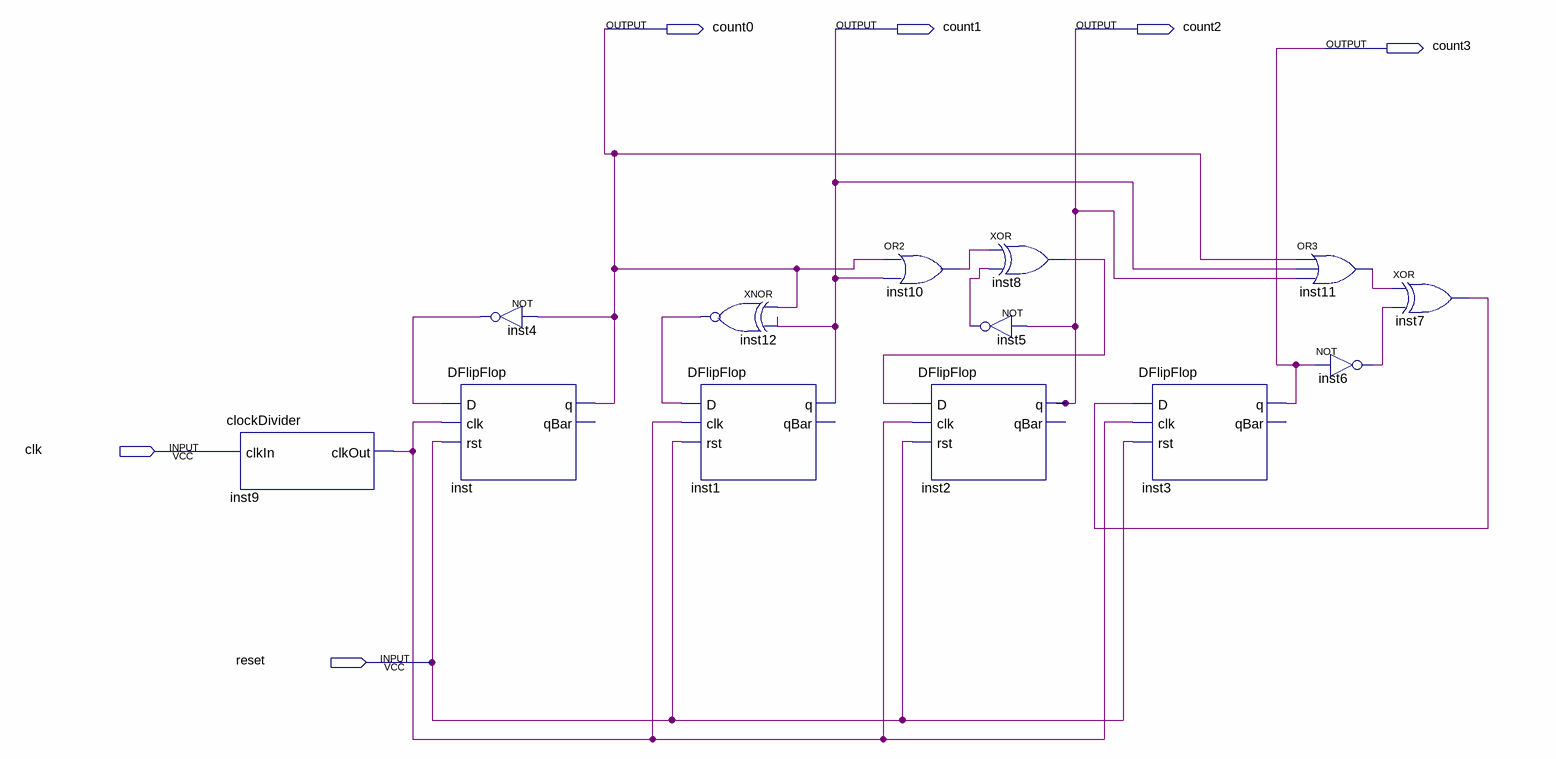
[diagram p0: schematic sheet]
// Quartus schematic synchronousCounterSchematic.bdf as structural Verilog: 13 symbols, 6 pins
module synchronousCounterSchematic (
  input  clk,
  input  reset,
  output count0,
  output count1,
  output count2,
  output count3
);

  wire inst4_out, inst5_out, inst6_out, inst7_out, inst8_out, inst9_clkout, inst10_out, inst11_out,
       inst12_out;

  clockDivider inst9 (.clkIn(clk), .clkOut(inst9_clkout));
  DFlipFlop inst (.D(inst4_out), .clk(inst9_clkout), .rst(reset), .q(count0));  // open: qBar
  not inst4 (inst4_out, count0);
  xnor inst12 (inst12_out, count0, count1);
  DFlipFlop inst1 (.D(inst12_out), .clk(inst9_clkout), .rst(reset), .q(count1));  // open: qBar
  or inst10 (inst10_out, count0, count1);
  DFlipFlop inst2 (.D(inst8_out), .clk(inst9_clkout), .rst(reset), .q(count2));  // open: qBar
  xor inst8 (inst8_out, inst10_out, inst5_out);
  not inst5 (inst5_out, count2);
  DFlipFlop inst3 (.D(inst7_out), .clk(inst9_clkout), .rst(reset), .q(count3));  // open: qBar
  or inst11 (inst11_out, count0, count1, count2);
  not inst6 (inst6_out, count3);
  xor inst7 (inst7_out, inst11_out, inst6_out);
endmodule
